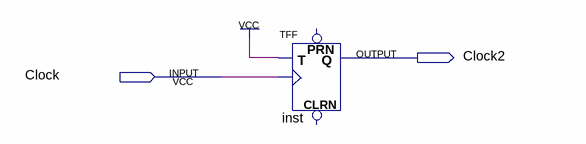
[diagram p0: schematic sheet]
// Quartus schematic Clockmult.bdf as structural Verilog: 1 symbols, 2 pins
module Clockmult (
  input  Clock,
  output Clock2
);

  TFF inst (.T(1'b1), .CLK(Clock), .Q(Clock2));  // open: PRN, CLRN
endmodule
